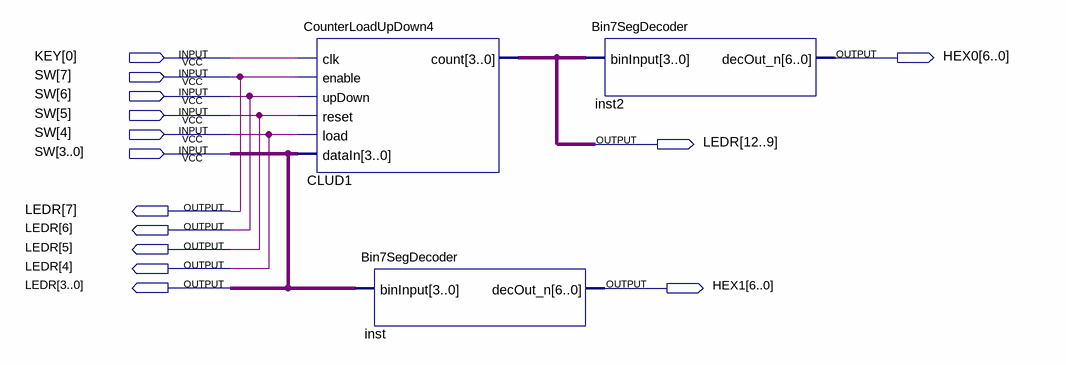
[diagram p0: schematic sheet]
// Quartus schematic CounterLoadUpDown4_Demo.bdf as structural Verilog: 3 symbols, 14 pins
module CounterLoadUpDown4_Demo (
  input  [0:0] KEY,
  input  [7:0] SW,
  output [6:0] HEX0,
  output [12:0] LEDR,
  output [6:0] HEX1
);

  CounterLoadUpDown4 CLUD1 (
    .clk(KEY[0]), .enable(SW[7]), .upDown(SW[6]), .reset(SW[5]), .load(SW[4]), .dataIn(SW[3:0]),
    .count(LEDR[12:9]));
  Bin7SegDecoder inst (.binInput(SW[3:0]), .decOut_n(HEX1));
  Bin7SegDecoder inst2 (.binInput(LEDR[12:9]), .decOut_n(HEX0));

  assign LEDR[7:0] = SW;
endmodule
